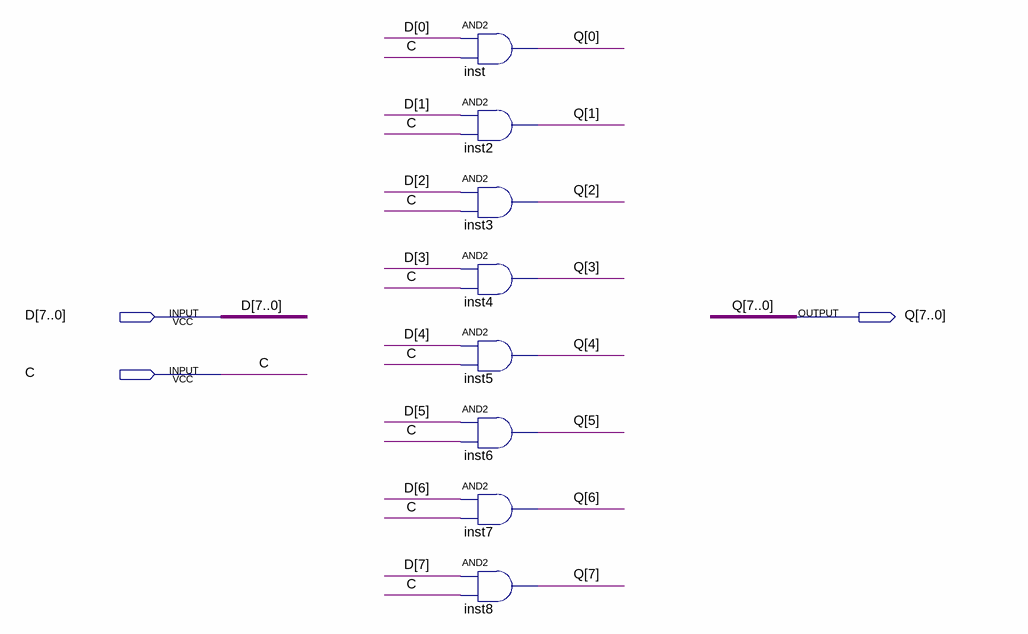
[diagram p0: schematic sheet]
// Quartus schematic AND_8BIT.bdf as structural Verilog: 8 symbols, 3 pins
module AND_8BIT (
  input  [7:0] D,
  input  C,
  output [7:0] Q
);

  and inst (Q[0], D[0], C);
  and inst2 (Q[1], D[1], C);
  and inst3 (Q[2], D[2], C);
  and inst4 (Q[3], D[3], C);
  and inst5 (Q[4], D[4], C);
  and inst6 (Q[5], D[5], C);
  and inst7 (Q[6], D[6], C);
  and inst8 (Q[7], D[7], C);
endmodule
